# Altium schematic sheet RxTx.SchDoc
size Letter; ENG_APP_DATE: --/--/--; DSN_APP_DATE: --/--/--; CHK_APP_DATE: --/--/--; SheetNumber: 1; SheetTotal: 5
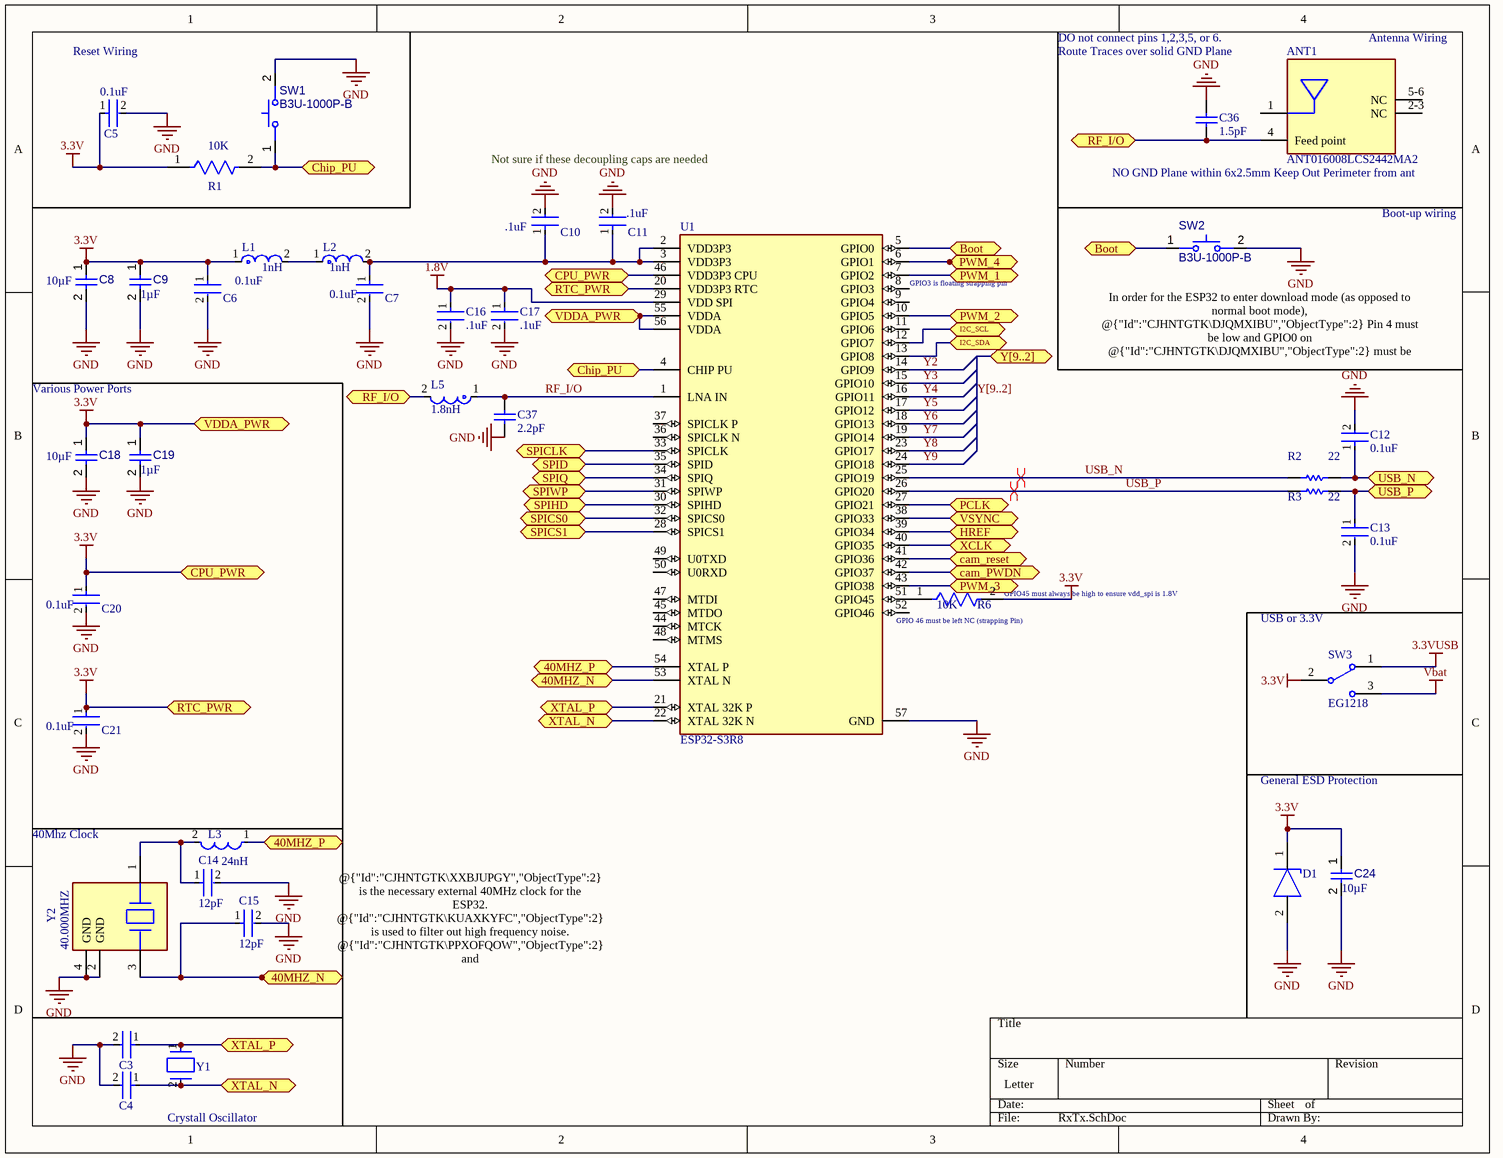
[diagram p0: RxTx.SchDoc]

## Parts
ANT1  ANT016008LCS2442MA2  [FP-ANT016008LCS2442MA2-0]
C3  GRM21A5C2E120FW01D  [FP-GRM21A-0_2-IPC_C]  (value not drawn)
C4  GRM21A5C2E120FW01D  [FP-GRM21A-0_2-IPC_C]  (value not drawn)
C5  0.1uF  [FP-GRM033-0_03-IPC_A]
C6  0.1uF  [FP-GRM033-0_03-IPC_A]
C7  0.1uF  [FP-GRM033-0_03-IPC_A]
C8  value 10µF  [CAPC0603(1608)100_L]  (hidden comment: Capacitor 10µF +/-20% 10V 0603)
C9  value 1µF  [CAPC1608X90X35ML15T15]  (hidden comment: Capacitor 1uF +/- 10% 16V 0603)
C10  .1uF  [FP-GRM033-0_03-IPC_A]
C11  .1uF  [FP-GRM033-0_03-IPC_A]
C12  0.1uF  [FP-GRM033-0_03-IPC_A]
C13  0.1uF  [FP-GRM033-0_03-IPC_A]
C14  12pF  [FP-GRM31A-0_2-e0_3_0_95-MFG]
C15  12pF  [FP-GRM31A-0_2-e0_3_0_95-MFG]
C16  .1uF  [FP-GRM033-0_03-IPC_A]
C17  .1uF  [FP-GRM033-0_03-IPC_A]
C18  value 10µF  [CAPC0603(1608)100_L]  (hidden comment: Capacitor 10µF +/-20% 10V 0603)
C19  value 1µF  [CAPC1608X90X35ML15T15]  (hidden comment: Capacitor 1uF +/- 10% 16V 0603)
C20  0.1uF  [FP-GRM033-0_03-IPC_A]
C21  0.1uF  [FP-GRM033-0_03-IPC_A]
C24  value 10µF  [CAPC0603(1608)100_L]  (hidden comment: Capacitor 10µF +/-20% 10V 0603)
C36  1.5pF  [CAPC0402(1005)60_M]
C37  2.2pF  [CAPC0402(1005)60_L]
D1  PTVS3V3P1UP,115  [FP-SOD128-MFG]  (value not drawn)
L1  1nH  [FP-LQG15HH_02-IPC_C]
L2  1nH  [FP-LQG15HH_02-IPC_C]
L3  24nH  [FP-LQW15AN_00-W0_5-0_1-MFG]
L5  1.8nH  [FP-LQG15HH_02-IPC_C]
R1  10K  [FP-CRGP0805-IPC_C]
R2  22  [RESC1005X40X25LL05T10]
R3  22  [RESC1005X40X25LL05T10]
R6  10K  [FP-CRGP0805-IPC_C]
SW1  B3U-1000P-B  [OMRON-B3U-1000P-2-B_V]
SW2  B3U-1000P-B  [OMRON-B3U-1000P-2-B_V]
SW3  EG1218  [ESWI-EG1218_V]
U1  ESP32-S3R8  [FP-ESP32-S3R8-IPC_A]
Y1  ABS07-32.768KHZ-9-T  [FP-ABS07-MFG]  (value not drawn)
Y2  40.000MHZ  [FP-ABM8-MFG]

## Ports
40MHZ_N (bidir), 40MHZ_P (bidir), Boot (bidir), cam_PWDN (bidir), cam_reset (bidir), Chip_PU (bidir), CPU_PWR (bidir), HREF (bidir), I2C_SCL (bidir), I2C_SDA (bidir), PCLK (bidir), PWM_1 (bidir), PWM_2 (bidir), PWM_3 (bidir), PWM_4 (bidir), RF_I/O (bidir), RTC_PWR (bidir), SPICLK (bidir), SPICS0 (bidir), SPICS1 (bidir), SPID (bidir), SPIHD (bidir), SPIQ (bidir), SPIWP (bidir), USB_N (bidir), USB_P (bidir), VDDA_PWR (bidir), VSYNC (bidir), XCLK (bidir), XTAL_N (bidir), XTAL_P (bidir), Y[9..2] (bidir)

## Nets
1.8V: C16.1 C17.1 U1.29(VDD_SPI)
3.3V: C5.1 C6.1 C8.1 C9.1 C18.1 C19.1 C20.1 C21.1 C24.1 D1.1(C) L1.1 R1.1 R6.2 SW3.2(COM) U1.20(VDD3P3_RTC) U1.46(VDD3P3_CPU) U1.55(VDDA) U1.56(VDDA) ; port VDDA_PWR, port CPU_PWR, port RTC_PWR
3.3VUSB: SW3.1
GND: C3.2 C4.2 C5.2 C6.2 C7.2 C8.2 C9.2 C10.2 C11.2 C12.2 C13.2 C14.2 C15.2 C16.2 C17.2 C18.2 C19.2 C20.2 C21.2 C24.2 C36.2 C37.2 D1.2(A) SW1.2 SW2.2 U1.57(GND) Y2.2(GND) Y2.4(GND)
Vbat: SW3.3
40MHZ_N: C15.1 U1.53(XTAL_N) Y2.3 ; port 40MHZ_N
40MHZ_P: L3.1 U1.54(XTAL_P) ; port 40MHZ_P
Boot: SW2.1 U1.5(GPIO0) ; port Boot
cam_PWDN: U1.42(GPIO37) ; port cam_PWDN
cam_reset: U1.41(GPIO36) ; port cam_reset
Chip_PU: R1.2 SW1.1 U1.4(CHIP_PU) ; port Chip_PU
HREF: U1.39(GPIO34) ; port HREF
I2C_SCL: U1.12(GPIO7) ; port I2C_SCL
I2C_SDA: U1.13(GPIO8) ; port I2C_SDA
PCLK: U1.27(GPIO21) ; port PCLK
PWM_1: U1.7(GPIO2) ; port PWM_1
PWM_2: U1.10(GPIO5) ; port PWM_2
PWM_3: U1.43(GPIO38) ; port PWM_3
PWM_4: U1.6(GPIO1) ; port PWM_4
RF_I/O: ANT1.4(Feed_point) C36.1 L5.2 ; port RF_I/O
RF_I/O: C37.1 L5.1 U1.1(LNA_IN)  [a separate net that carries the same name]
SPICLK: U1.33(SPICLK) ; port SPICLK
SPICS0: U1.32(SPICS0) ; port SPICS0
SPICS1: U1.28(SPICS1) ; port SPICS1
SPID: U1.35(SPID) ; port SPID
SPIHD: U1.30(SPIHD) ; port SPIHD
SPIQ: U1.34(SPIQ) ; port SPIQ
SPIWP: U1.31(SPIWP) ; port SPIWP
USB_N: R2.1 U1.25(GPIO19)
USB_N: C12.1 R2.2 ; port USB_N  [a separate net that carries the same name]
USB_P: R3.1 U1.26(GPIO20)
USB_P: C13.1 R3.2 ; port USB_P  [a separate net that carries the same name]
VSYNC: U1.38(GPIO33) ; port VSYNC
XCLK: U1.40(GPIO35) ; port XCLK
XTAL_N: C4.1 U1.22(XTAL_32K_N) Y1.2 ; port XTAL_N
XTAL_P: C3.1 U1.21(XTAL_32K_P) Y1.1 ; port XTAL_P
Y2: U1.14(GPIO9)
Y3: U1.15(GPIO10)
Y4: U1.16(GPIO11)
Y5: U1.17(GPIO12)
Y6: U1.18(GPIO13)
Y7: U1.19(GPIO14)
Y8: U1.23(GPIO17)
Y9: U1.24(GPIO18)
NetC7_1: C7.1 C10.1 C11.1 L2.2 U1.2(VDD3P3) U1.3(VDD3P3)
NetC14_1: C14.1 L3.2 Y2.1
NetL1_2: L1.2 L2.1
NetR6_1: R6.1 U1.51(GPIO45)

Not connected (* = marked no-connect by the designer): ANT1 1(Radiator_electrode) 2-3(NC) 5-6(NC); U1 8(GPIO3) 9(GPIO4) 11(GPIO6) 36(SPICLK_N) 37(SPICLK_P) 44(MTCK) 45(MTDO) 47(MTDI) 48(MTMS) 49(U0TXD) 50(U0RXD) 52(GPIO46)

## Buses and harness runs
bus Y[9..2] = port Y[9..2]

## Layout directives
differential pair: USB_N, USB_P

## Notes on the sheet
- Reset Wiring
- DO not connect pins 1,2,3,5, or 6.
- Route Traces over solid GND Plane
- Antenna Wiring
- Not sure if these decoupling caps are needed
- NO GND Plane within 6x2.5mm Keep Out Perimeter from ant
- Boot-up wiring
- (near U1) GPIO3 is floating strapping pin
- Type @ to refer to a designator
- (near SW2) In order for the ESP32 to enter download mode (as opposed to normal boot mode), @{"Id":"CJHNTGTK\DJQMXIBU","ObjectType":2} Pin 4 must be low and GPIO0 on @{"Id":"CJHNTGTK\DJQMXIBU","ObjectType":2} must be low. In order to achieve this press @{"Id":"CJHNTGTK\SEUIVYGS","ObjectType":2} & @{"Id":"CJHNTGTK\DHJPIHSD","ObjectType":2} @ the same time as GPIO0 is a strapping pin and has an internal PU Resistor.
- Various Power Ports
- GPIO 46 must be left NC (strapping Pin)
- (near R6) GPIO45 must always be high to ensure vdd_spi is 1.8V
- (near SW3) USB or 3.3V
- (near Y2) 40Mhz Clock
- General ESD Protection
- @{"Id":"CJHNTGTK\XXBJUPGY","ObjectType":2} is the necessary external 40MHz clock for the ESP32. @{"Id":"CJHNTGTK\KUAXKYFC","ObjectType":2} is used to filter out high frequency noise. @{"Id":"CJHNTGTK\PPXOFQOW","ObjectType":2} and @{"Id":"CJHNTGTK\RYRNBWFY","ObjectType":2} are assuming a C_stray of 4pF and using CL = C1/2 + C_stray for the formula. (This formula assumes the two capacitors have the same value).
- Crystall Oscillator

## Library data of the parts
ANT1 = CMP-08339-000002-1: RF ANT 2.4GHZ CHIP SOLDER SMD; Manufacturer: TDK Corporation; Max Frequency: 2484MHz; Impedance: 50Ω; Number Of Bands: 1; Bandwidth: 2400-2484MHz; Temperature: -40°C to +85°C; Device Class L1: Integrated Circuits (ICs); Lead Free: Yes; ComponentLink2Description: Datasheet; RoHS: TRUE; Temperature Range High: +85°C; Package: ANT016008LCS2442MA2; Temperature Range Low: -40°C; ComponentLink2URL: https://product.tdk.com/info/en/documents/data_sheet/rf_ant_ant016008lcs2442ma2_summary_en.pdf; Height: 0.4mm; Octopart: https://octopart.com/ant016008lcs2442ma2-tdk-48293801; Device Class L3: RF Antennas; Device Class L2: RF Semiconductors and Devices; Digikey Description: RF ANT 2.4GHZ CHIP SOLDER SMD; Category: Ant; Automotive: No; Manufacturer Part Number: ANT016008LCS2442MA2
C3 C4 = CMP-06035-038672-1: Chip Multilayer Ceramic Capacitors for General Purpose, 0805, 12pF, C0G, 30ppm/°C, 1%, 250V
C5-C7 C10-C13 C16 C17 C20 C21 = CMP-06035-043202-1: Chip Multilayer Ceramic Capacitors for General Purpose, 0201, 0.10uF, X7R, 15%, 10%, 16V
C8 C18 C24 = CMP-001-00075-4: Chip Capacitor, 10µF +/-20%, 10V, 0603, Thickness 1 mm; Tolerance: 10%; Voltage Rating: 10V; Max Operating Temperature: 85°C; Pins: 2; Case/Package: 0603; Mounting Technology: SMT; Min Operating Temperature: -55°C
C9 C19 = CMP-001-00004-6: Chip Capacitor, 1 uF, +/- 10%, 16 V, 0603 (1608 Metric); Capacitor Type: Ceramic; Mounting Technology: SM; RoHS Compliant: True; Min Operating Temperature: -55°C; Case/Package: 0603; Pins: 2; Voltage Rating: 16V; Max Operating Temperature: 125°C; Tolerance: 10%
C14 C15 = CMP-06035-037569-1: Chip Multilayer Ceramic Capacitors for General Purpose, 1206, 12pF, C0G, 30ppm/°C, 5%, 1kV; Thickness: 0.039inch; Termination: SMD/SMT; Package Quantity: 4000; Dielectric: C0G; Case Code (Imperial): 1206; Width: 1.6mm; Height: 1mm; Packaging: Tape and Reel; Voltage Rating (DC): 1kV; Max Operating Temperature: 125°C; Case Code (Metric): 3216; Capacitance: 12pF; Length: 0.126inch; Case/Package: 1206; Voltage Rating: 1kV; Min Operating Temperature: -55°C; Mount: Surface Mount; Tolerance: 5%
C36 = CMP-1034-00102-1: CAP 1.5pF 10V ±0.1pF 0402 (1005 Metric) Thickness 0.6mm SMD; Case-EIA: 0402; Tolerance: Â±0.1pF; Case-Metric: 1005; Rated Voltage: 10 V; Technology: SMT; Value: 1.5pF; Max Thickness: 0.6 mm
C37 = CMP-1034-00170-1: CAP 2.2pF 25V ±0.1pF 0402 (1005 Metric) Thickness 0.6mm SMD; Case-EIA: 0402; Case-Metric: 1005; Tolerance: Â±0.1pF; Rated Voltage: 25 V; Max Thickness: 0.6 mm; Technology: SMT; Value: 2.2pF
D1 = CMP-14436-000013-1: TVS DIODE 3.3V 8V CFP5; RoHS Compliant: Yes
L1 L2 = CMP-06042-000103-1: Multilayer type RF Inductor 1nH ±0.3nH 0.07Ω 1000mA 0402; Shielding: Unshielded; DC Current: 300mA; Q Factor: 8; Self Resonant Frequency: 6GHz; Core Material: Air; Test Frequency: 100MHz; DC Resistance (DCR): 100mR; Case Code (Imperial): 0402; Max Operating Temperature: 125°C; Max DC Current: 300mA; Mount: Surface Mount; Package Quantity: 1; Current Rating: 300mA; Case Code (Metric): 1005; Number of Pins: 2; Packaging: Tape and Reel; Termination: SMD/SMT; Radiation Hardening: No; Width: 0.5mm; Case/Package: 0402; REACH SVHC: No SVHC; Military Standard: Not; Lead Free: Lead Free; Min Operating Temperature: -55°C; Height - Seated (Max): 0.022inch; Length: 0.039inch; Height: 0.02inch; Inductance: 1nH; Depth: 0.55mm
L3 = CMP-06042-007532-1: Wire Wound RF Inductor 24nH ±2% 280mA 0.52Ω 0402 (1005); Q Factor: 25; Core Material: Air; Test Frequency: 100MHz; Current: 270mA; Self Resonant Frequency: 3.5GHz; Shielding: Unshielded; DC Resistance (DCR): 520mR; Height: 0.5mm; Lead Free: Lead Free; Max DC Current: 280mA; Width: 0.02inch; Number of Pins: 2; Inductance Tolerance: 2%; Military Standard: Not; REACH SVHC: No SVHC; Case Code (Imperial): 0402; Inductance: 24nH; Case/Package: 0402; Current Rating: 280mA; Min Operating Temperature: -55°C; Case Code (Metric): 1005; Length: 1mm; Mount: Surface Mount; DC Current: 280mA; Weight: 2.8E-05oz; Package Quantity: 10000; Termination: SMD/SMT; Packaging: Tape and Reel; Max Operating Temperature: 125°C; Depth: 0.6mm; Tolerance: 2%
L5 = CMP-06042-005877-1: Multilayer type RF Inductor 1.8nH ±0.3nH 0.08Ω 950mA 0402; Self Resonant Frequency: 6GHz; Core Material: Air; DC Current: 300mA; Q Factor: 8; Test Frequency: 100MHz; Shielding: Unshielded; DC Resistance (DCR): 100mR; Inductance: 1.8nH; Packaging: Tape and Reel; Lead Free: Lead Free; Min Operating Temperature: -55°C; Height - Seated (Max): 0.022inch; Case/Package: 0402; Mount: Surface Mount; Package Quantity: 1; Width: 0.02inch; Length: 0.039inch; Max Operating Temperature: 125°C; Depth: 0.55mm; Height: 0.5mm; Radiation Hardening: No; Max DC Current: 300mA; Case Code (Metric): 1005; Termination: SMD/SMT; Military Standard: Not; Current Rating: 300mA; Case Code (Imperial): 0402
R1 R6 = CMP-03211-006861-1: CRGP 0805 10K 1%; Manufacturer Part Number: CRGP0805F10K; Manufacturer: TE; Power Rating: 0.33W; Voltage Rating: 150V; Value: 10KΩ; Tolerance: 0.01; Temperature Coefficient: ±100ppm/°C; ComponentLink2URL: https://www.mouser.com/datasheet/2/418/NG_DS_9-1773463-9_A-1358566.pdf; Temperature Range Low: -55°C; Ipc Land Pattern Name: RESC200125X55; Device Class L2: Resistors; Automotive: No; Device Class L3: Chip SMD Resistors; Composition: Thick Film; Temperature Range High: +155°C; Temperature: -55°C to +155°C; Height: 0.65mm; Series: CRGP; RoHS: TRUE; Device Class L1: Passive Components; Octopart: https://octopart.com/crgp0805f10k-te+connectivity-91018782; Package: CRGP0805; Digikey Description: CRGP 0805 10K 1%; Ambient Temperature Range High: +70°C; Lead Free: Yes; ComponentLink2Description: Datasheet; Category: Res; Resistance: 10KΩ
R2 R3 = CMP-2002-08075-1: Part Number: RC0402JR-1322RL; Manufacturer: Yageo
SW1 SW2 = CMP-011-00011-3: Ultra-small Surface-mounting Tactile Switches with High Contact Reliability, SPST-NO, -25 to 70 degC, 2-Pin SMD, RoHS, Tape and Reel; Voltage Rating: 12V; Current Rating: 50mA; Pins: 2; RoHS Compliant: Details
SW3 = CMP-011-00006-2: Slide Switch, SPDT, 500 V, -20 to 70 degC, 3-Pin THD, RoHS, Bulk; Manufacturer: E-Switch; Voltage Rating (DC): 30V; Current Rating: 200mA; Operating Force: 250gf; Package Quantity: 1000; Contact Plating: Silver; Max Operating Temperature: 70°C; Min Operating Temperature: -20°C; Contact Material: Copper; Datasheet URL: https://www.e-switch.com/system/asset/product_line/data_sheet/119/EG.pdf; Contact Finish: Silver; Case/Package: EG1218; Voltage Rating (AC): 30V; Datasheet Version: Oct-15; Package Description: 3-Pin Through Hole Device, Body 11.6 x 4 mm, Pitch 2.5 mm; RoHS Compliant: True; Package Reference: EG1218; Manufacturer URL: http://www.e-switch.ch/en/; Throw Configuration: SPDT; Contact Current Rating: 200mA; Mounting Technology: TH; Packaging: Bulk; Pins: 3
U1 = CMP-10700-118292493-1: ESP32-S3R8 RF System on a Chip - SoC SMD IC, Dual-Core MCU, Wi-Fi 2.4G BLE 5.0 Combo; NexarPartId: 118292493
Y1 = CMP-27762-013661-2: Crystal 32.768kHz ±20ppm (Tol) 9pF FUND 70kΩ 2-Pin CSMD T/R; Insulation Resistance: 500MR; Series Resistance: 70kR; Packaging: Tape and Reel; Length: 3.2mm; Max Operating Temperature: 85°C; Mount: Surface Mount; Height: 0.9mm; Number of Pins: 2; Depth: 1.5mm; Series: ABS07; REACH SVHC: No SVHC; Tolerance: 20ppm; Radiation Hardening: No; Case/Package: CSMD; Package Quantity: 3000; Termination: SMD/SMT; Operating Frequency: 32.768 kHz; Width: 1.5mm; Load Capacitance: 9pF; Lead Free: Lead Free; Frequency Tolerance: 20ppm; Frequency Stability: 20ppm; Frequency: 32.768kHz; ESR (Equivalent Series Resistance): 70kR; RoHS Compliant: Yes; Min Operating Temperature: -40°C
Y2 = CMP-27762-008947-1: Crystal 40MHz ±10ppm 10pF SMD-4 3.2mm x 2.5mm; ESR (Equivalent Series Resistance): 35R; Frequency: 40MHz; Number of Pins: 4; Frequency Stability: 10ppm; Radiation Hardening: No; Tolerance: 10ppm; Min Operating Temperature: -10°C; Resistor Type: Ceramic; Width: 0.098inch; Max Operating Temperature: 60°C; Case/Package: SMD/SMT; Packaging: Tape and Reel; Mount: Surface Mount; Termination: SMD/SMT; Load Capacitance: 10pF; Series: ABM8; Height: 0.031inch; Frequency Tolerance: 10ppm; Operating Frequency: 40 MHz; Package Quantity: 1000; Length: 0.126inch; Lead Free: Lead Free